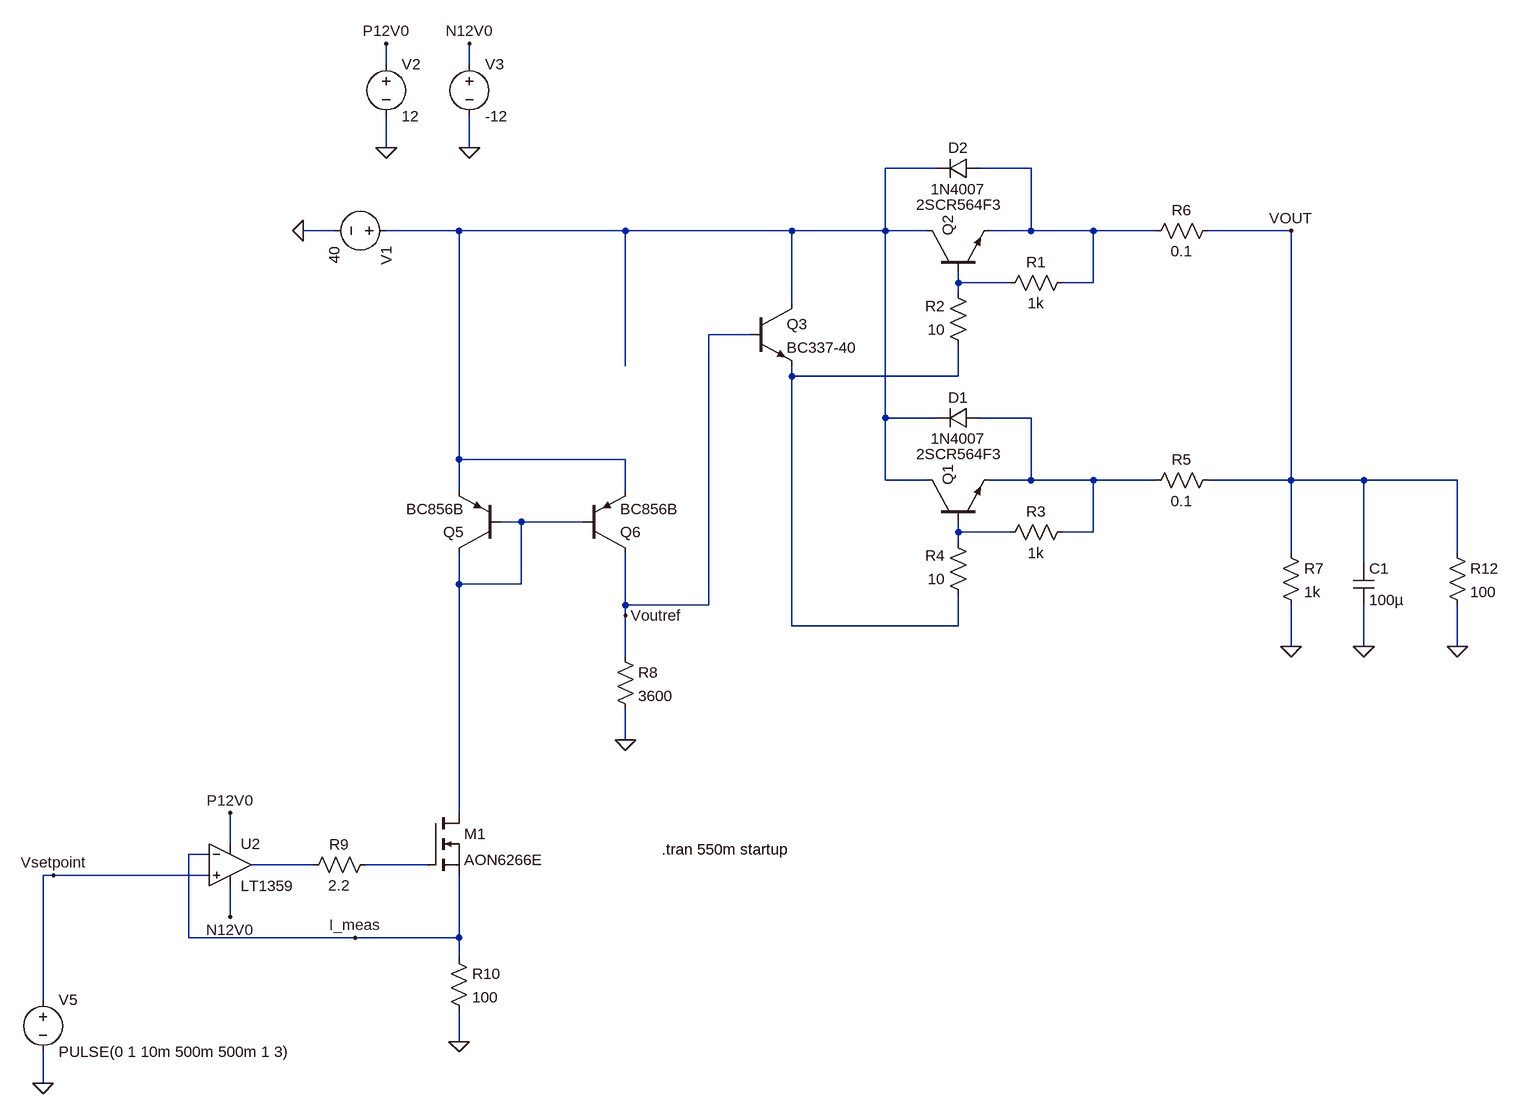
[diagram p0: schematic PowerBoard_PowerSectionNew.asc]
PowerBoard_PowerSectionNew.asc, the LTspice schematic file:
Version 4.1
SHEET 1 1732 1188
WIRE 16 -544 16 -576
WIRE 144 -544 144 -576
WIRE 16 -416 16 -464
WIRE 144 -416 144 -464
WIRE 864 -384 784 -384
WIRE 1008 -384 928 -384
WIRE -64 -288 -112 -288
WIRE 128 -288 16 -288
WIRE 384 -288 128 -288
WIRE 640 -288 384 -288
WIRE 784 -288 784 -384
WIRE 784 -288 640 -288
WIRE 848 -288 784 -288
WIRE 1008 -288 1008 -384
WIRE 1008 -288 944 -288
WIRE 1104 -288 1008 -288
WIRE 1200 -288 1104 -288
WIRE 1408 -288 1280 -288
WIRE 896 -208 896 -224
WIRE 976 -208 896 -208
WIRE 1104 -208 1104 -288
WIRE 1104 -208 1056 -208
WIRE 896 -192 896 -208
WIRE 640 -176 640 -288
WIRE 576 -128 512 -128
WIRE 384 -80 384 -288
WIRE 640 -64 640 -80
WIRE 896 -64 896 -112
WIRE 896 -64 640 -64
WIRE 784 0 784 -288
WIRE 864 0 784 0
WIRE 1008 0 928 0
WIRE 128 64 128 -288
WIRE 384 64 128 64
WIRE 784 96 784 0
WIRE 848 96 784 96
WIRE 1008 96 1008 0
WIRE 1008 96 944 96
WIRE 1104 96 1008 96
WIRE 1200 96 1104 96
WIRE 1408 96 1408 -288
WIRE 1408 96 1280 96
WIRE 1520 96 1408 96
WIRE 1664 96 1520 96
WIRE 128 112 128 64
WIRE 384 112 384 64
WIRE 224 160 192 160
WIRE 320 160 224 160
WIRE 896 176 896 160
WIRE 976 176 896 176
WIRE 1104 176 1104 96
WIRE 1104 176 1056 176
WIRE 896 192 896 176
WIRE 1408 208 1408 96
WIRE 1664 208 1664 96
WIRE 1520 224 1520 96
WIRE 128 256 128 208
WIRE 224 256 224 160
WIRE 224 256 128 256
WIRE 384 288 384 208
WIRE 512 288 512 -128
WIRE 512 288 384 288
WIRE 384 304 384 288
WIRE 640 320 640 -64
WIRE 896 320 896 272
WIRE 896 320 640 320
WIRE 1408 352 1408 288
WIRE 1520 352 1520 288
WIRE 1664 352 1664 288
WIRE 384 368 384 304
WIRE 384 496 384 448
WIRE 128 608 128 256
WIRE -224 656 -224 608
WIRE -256 672 -288 672
WIRE -96 688 -192 688
WIRE 80 688 -16 688
WIRE -496 704 -512 704
WIRE -256 704 -496 704
WIRE -224 768 -224 720
WIRE -288 800 -288 672
WIRE -32 800 -288 800
WIRE 128 800 128 704
WIRE 128 800 -32 800
WIRE 128 832 128 800
WIRE -512 896 -512 704
WIRE 128 960 128 912
WIRE -512 1024 -512 976
FLAG -112 -288 0
FLAG 1408 352 0
FLAG 16 -416 0
FLAG 16 -576 P12V0
FLAG 144 -416 0
FLAG 144 -576 N12V0
FLAG 1408 -288 VOUT
FLAG 1520 352 0
FLAG 1664 352 0
FLAG 384 496 0
FLAG -224 608 P12V0
FLAG -224 768 N12V0
FLAG 128 960 0
FLAG -32 800 I_meas
FLAG 384 304 Voutref
FLAG -512 1024 0
FLAG -496 704 Vsetpoint
SYMBOL voltage 32 -288 R90
WINDOW 123 0 0 Left 0
WINDOW 39 0 0 Left 0
SYMATTR InstName V1
SYMATTR Value 40
SYMBOL npn 848 160 R270
WINDOW 3 104 -17 VRight 2
SYMATTR Value 2SCR564F3
SYMATTR InstName Q1
SYMBOL res 1072 160 R90
WINDOW 0 0 56 VBottom 2
WINDOW 3 32 56 VTop 2
SYMATTR InstName R3
SYMATTR Value 1k
SYMBOL res 912 288 R180
WINDOW 0 36 76 Left 2
WINDOW 3 36 40 Left 2
SYMATTR InstName R4
SYMATTR Value 10
SYMBOL diode 928 -16 R90
WINDOW 0 0 32 VBottom 2
WINDOW 3 32 32 VTop 2
SYMATTR InstName D1
SYMATTR Value 1N4007
SYMBOL res 1296 80 R90
WINDOW 0 0 56 VBottom 2
WINDOW 3 32 56 VTop 2
SYMATTR InstName R5
SYMATTR Value 0.1
SYMBOL npn 848 -224 R270
WINDOW 3 104 -17 VRight 2
SYMATTR Value 2SCR564F3
SYMATTR InstName Q2
SYMBOL res 1072 -224 R90
WINDOW 0 0 56 VBottom 2
WINDOW 3 32 56 VTop 2
SYMATTR InstName R1
SYMATTR Value 1k
SYMBOL res 912 -96 R180
WINDOW 0 36 76 Left 2
WINDOW 3 36 40 Left 2
SYMATTR InstName R2
SYMATTR Value 10
SYMBOL diode 928 -400 R90
WINDOW 0 0 32 VBottom 2
WINDOW 3 32 32 VTop 2
SYMATTR InstName D2
SYMATTR Value 1N4007
SYMBOL res 1296 -304 R90
WINDOW 0 0 56 VBottom 2
WINDOW 3 32 56 VTop 2
SYMATTR InstName R6
SYMATTR Value 0.1
SYMBOL res 1392 192 R0
SYMATTR InstName R7
SYMATTR Value 1k
SYMBOL voltage 16 -560 R0
WINDOW 123 0 0 Left 0
WINDOW 39 0 0 Left 0
SYMATTR InstName V2
SYMATTR Value 12
SYMBOL voltage 144 -560 R0
WINDOW 123 0 0 Left 0
WINDOW 39 0 0 Left 0
SYMATTR InstName V3
SYMATTR Value -12
SYMBOL cap 1504 224 R0
SYMATTR InstName C1
SYMATTR Value 100µ
SYMBOL res 1648 192 R0
SYMATTR InstName R12
SYMATTR Value 100
SYMBOL npn 576 -176 R0
SYMATTR InstName Q3
SYMATTR Value BC337-40
SYMBOL res 368 352 R0
SYMATTR InstName R8
SYMATTR Value 3600
SYMBOL res 0 672 R90
WINDOW 0 0 56 VBottom 2
WINDOW 3 32 56 VTop 2
SYMATTR InstName R9
SYMATTR Value 2.2
SYMBOL res 112 816 R0
SYMATTR InstName R10
SYMATTR Value 100
SYMBOL pnp 192 208 R180
SYMATTR InstName Q5
SYMATTR Value BC856B
SYMBOL pnp 320 208 M180
SYMATTR InstName Q6
SYMATTR Value BC856B
SYMBOL OpAmps\\LT1359 -224 624 R0
SYMATTR InstName U2
SYMBOL nmos 80 608 R0
SYMATTR InstName M1
SYMATTR Value AON6266E
SYMBOL voltage -512 880 R0
WINDOW 123 0 0 Left 0
WINDOW 39 0 0 Left 0
SYMATTR InstName V5
SYMATTR Value PULSE(0 1 10m 500m 500m 1 3)
TEXT 440 664 Left 2 !.tran 550m startup

The netlist it stands for:
* PowerBoard_PowerSectionNew.asc
V1 N001 0 40
Q1 N001 N007 N005 0 2SCR564F3
R3 N005 N007 1k
R4 N004 N007 10
D1 N005 N001 1N4007
R5 VOUT N005 0.1
Q2 N001 N003 N002 0 2SCR564F3
R1 N002 N003 1k
R2 N004 N003 10
D2 N002 N001 1N4007
R6 VOUT N002 0.1
R7 VOUT 0 1k
V2 P12V0 0 12
V3 N12V0 0 -12
C1 VOUT 0 100µ
R12 VOUT 0 100
Q3 N001 Voutref N004 0 BC337-40
R8 Voutref 0 3600
R9 N009 N008 2.2
R10 I_meas 0 100
Q5 N006 N006 N001 0 BC856B
Q6 Voutref N006 N001 0 BC856B
X§U2 Vsetpoint I_meas P12V0 N12V0 N008 LT1359  ; pins In+ In- V+ V- OUT
M1 N006 N009 I_meas I_meas AON6266E
V5 Vsetpoint 0 PULSE(0 1 10m 500m 500m 1 3)
.model D D
.lib standard.dio
.model NPN NPN
.model PNP PNP
.lib standard.bjt
.model NMOS NMOS
.model PMOS PMOS
.lib standard.mos
.tran 550m startup
.backanno
.end